# Altium schematic sheet 5-LORA.SchDoc
size A4
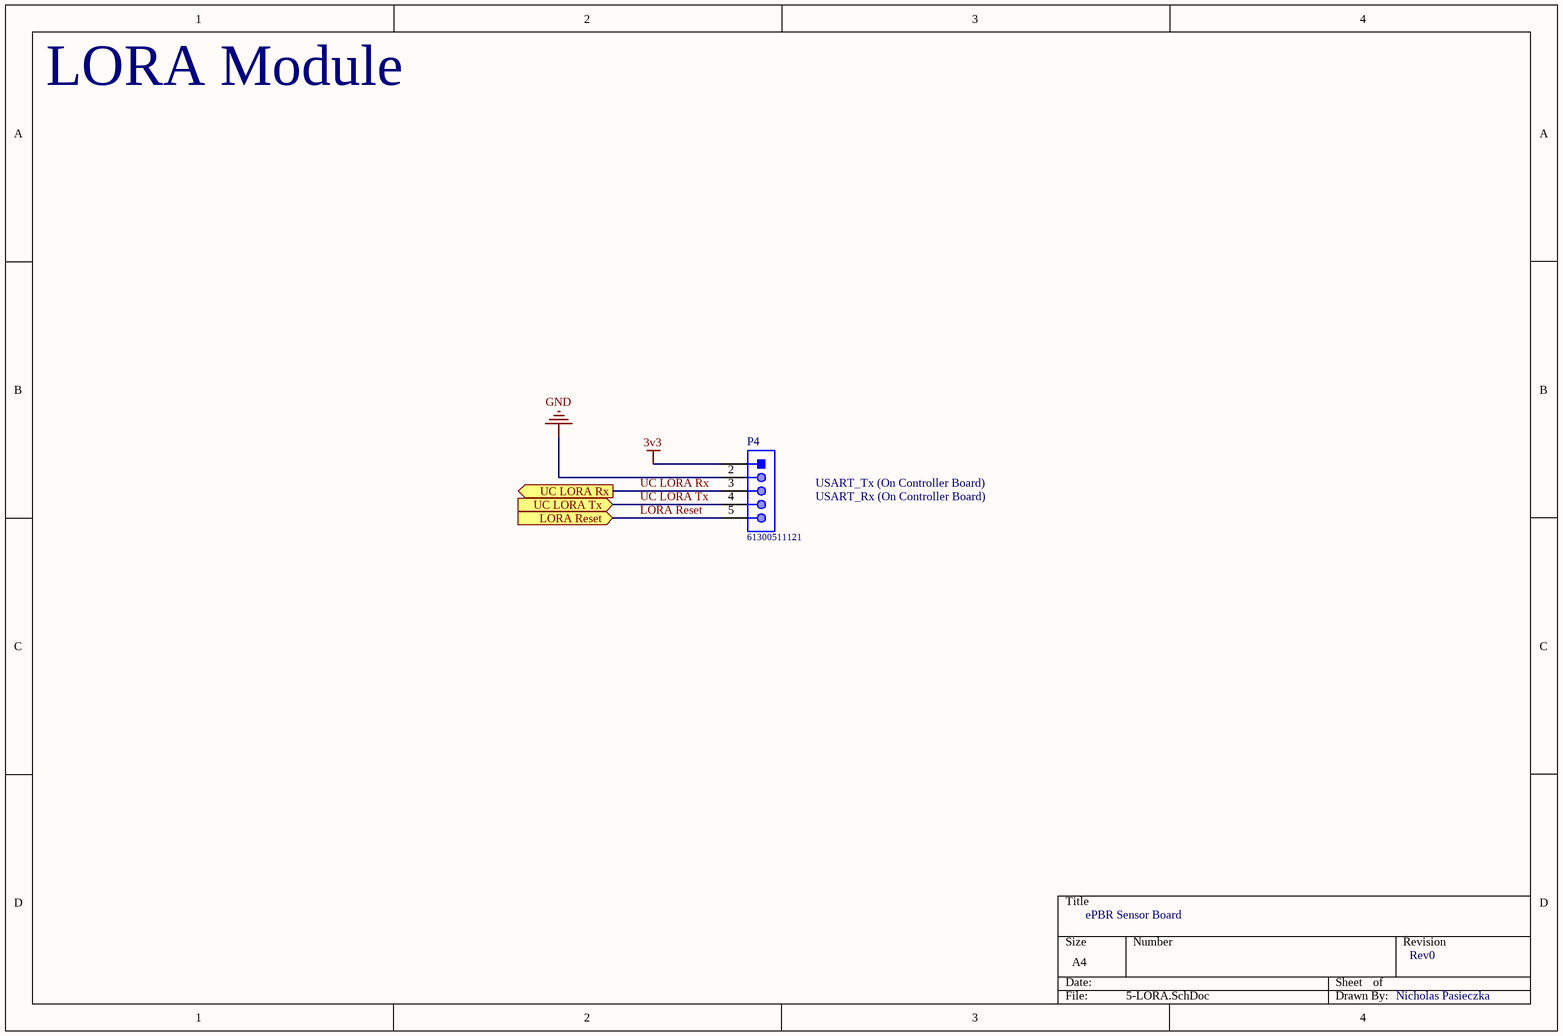
[diagram p0: 5-LORA.SchDoc]

## Parts
P4  61300511121  [61300511121]

## Ports
LORA Reset (in), UC LORA Rx (out), UC LORA Tx (in)

## Nets
3v3: P4.1
GND: P4.2
LORA Reset: P4.5 ; port LORA Reset
UC LORA Rx: P4.3 ; port UC LORA Rx
UC LORA Tx: P4.4 ; port UC LORA Tx

## Notes on the sheet
- LORA Module
- USART_Tx (On Controller Board)
- USART_Rx (On Controller Board)
- ePBR Sensor Board
- Rev0
- Nicholas Pasieczka

## Library data of the parts
P4 = CMP-1502-01068-1: THT Vertical Pin Header WR-PHD, Pitch 2.54 mm, Single Row, 5 pins; Manufacturer: Wurth Elektronik; Pin Number: 5; Contact Resistance: 20mOhm; Working Voltage: 250VAC; Pitch: 2.54mm; Withstanding Voltage: 500VAC; Rated Current: 3A; Gender: Male; Datasheet URL: https://katalog.we-online.de/em/datasheet/6130xx11121.pdf; Orientation: Vertical; Mounting Technology: THT; Row Number: Single; Package Reference: 61300511121; Publisher: WurthElektronik; Part Number: 61300511121; Packaging: Bag; Manufacturer URL: http://www.we-online.de; Operating Temperature: -40to105degC